# Altium schematic sheet SMF6.0CA_C2990473.schdoc
size 127 x 101 mm
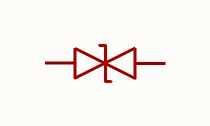
[diagram p0: SMF6.0CA_C2990473.schdoc]

## Parts
U?  smf6.0ca_c2990473  [SOD-123FL_L2.8-W1.8-LS3.7-BI]  (value not drawn)

## Nets

Not connected (* = marked no-connect by the designer): U? 1 2

## Library data of the parts
U? = smf6.0ca_c2990473: 极性:双向;反向截止电压(Vrwm):6V;钳位电压:10.3V;峰值脉冲电流(Ipp):19.4A;峰值脉冲功率(Ppp):200W;击穿电压:6.67V;; Manufacturer: Liown(里阳半导体); AddInBom: yes; ModelId: d105299b3871451c86f679efef28ff8f; ModelTransform: 145.669,70.866,0,0,0,0,0,0,0; Polarity: 双向; Reverse Stand-Off Voltage (Vrwm): 6V; Clamping Voltage: 10.3V; Peak Pulse Current (Ipp): 19.4A; Peak Pulse Power Dissipation (Ppp): 200W; Voltage - Breakdown: 6.67V; Reverse Leakage Current (Ir): 400uA; level of protection: IEC 61000-4-2; Symbol: SMF6.0CA_C2990473; LCSC Part Name: 双向TVS 6V截止 峰值浪涌电流：19.4A; SupplierPart: C2990473; ManufacturerPart: SMF6.0CA; Supplier Footprint: SOD-123FL; JLCPCB Part Class: Extended Part; Datasheet: https://item.szlcsc.com/datasheet/SMF6.0CA/3449907.html; Supplier: LCSC; ConvertToPcb: yes; FootprintName: SOD-123FL_L2.8-W1.8-LS3.7-BI; ModelName: SOD-123FL_L2.8-W1.8-LS3.7-BI; Operating Temperature: -55℃~+150℃; Type: TVS